# Altium schematic sheet 1_P1.schdoc
size 431 x 309 mm; Symbol: Sheet-Symbol_A3; Device: Sheet-Symbol_A3; Company: 嘉立创EDA; @Project Name: 蓝牙音响; @Page Count: 1; @Update Date: 2025-04-14; @Create Date: 2025-04-14; @Schematic Name: Schematic1_2; @Page No: 1; @Page Name: P1; @Board Name: 开发板; @Create Time: 15:54:00; @Update Time: 16:00:57
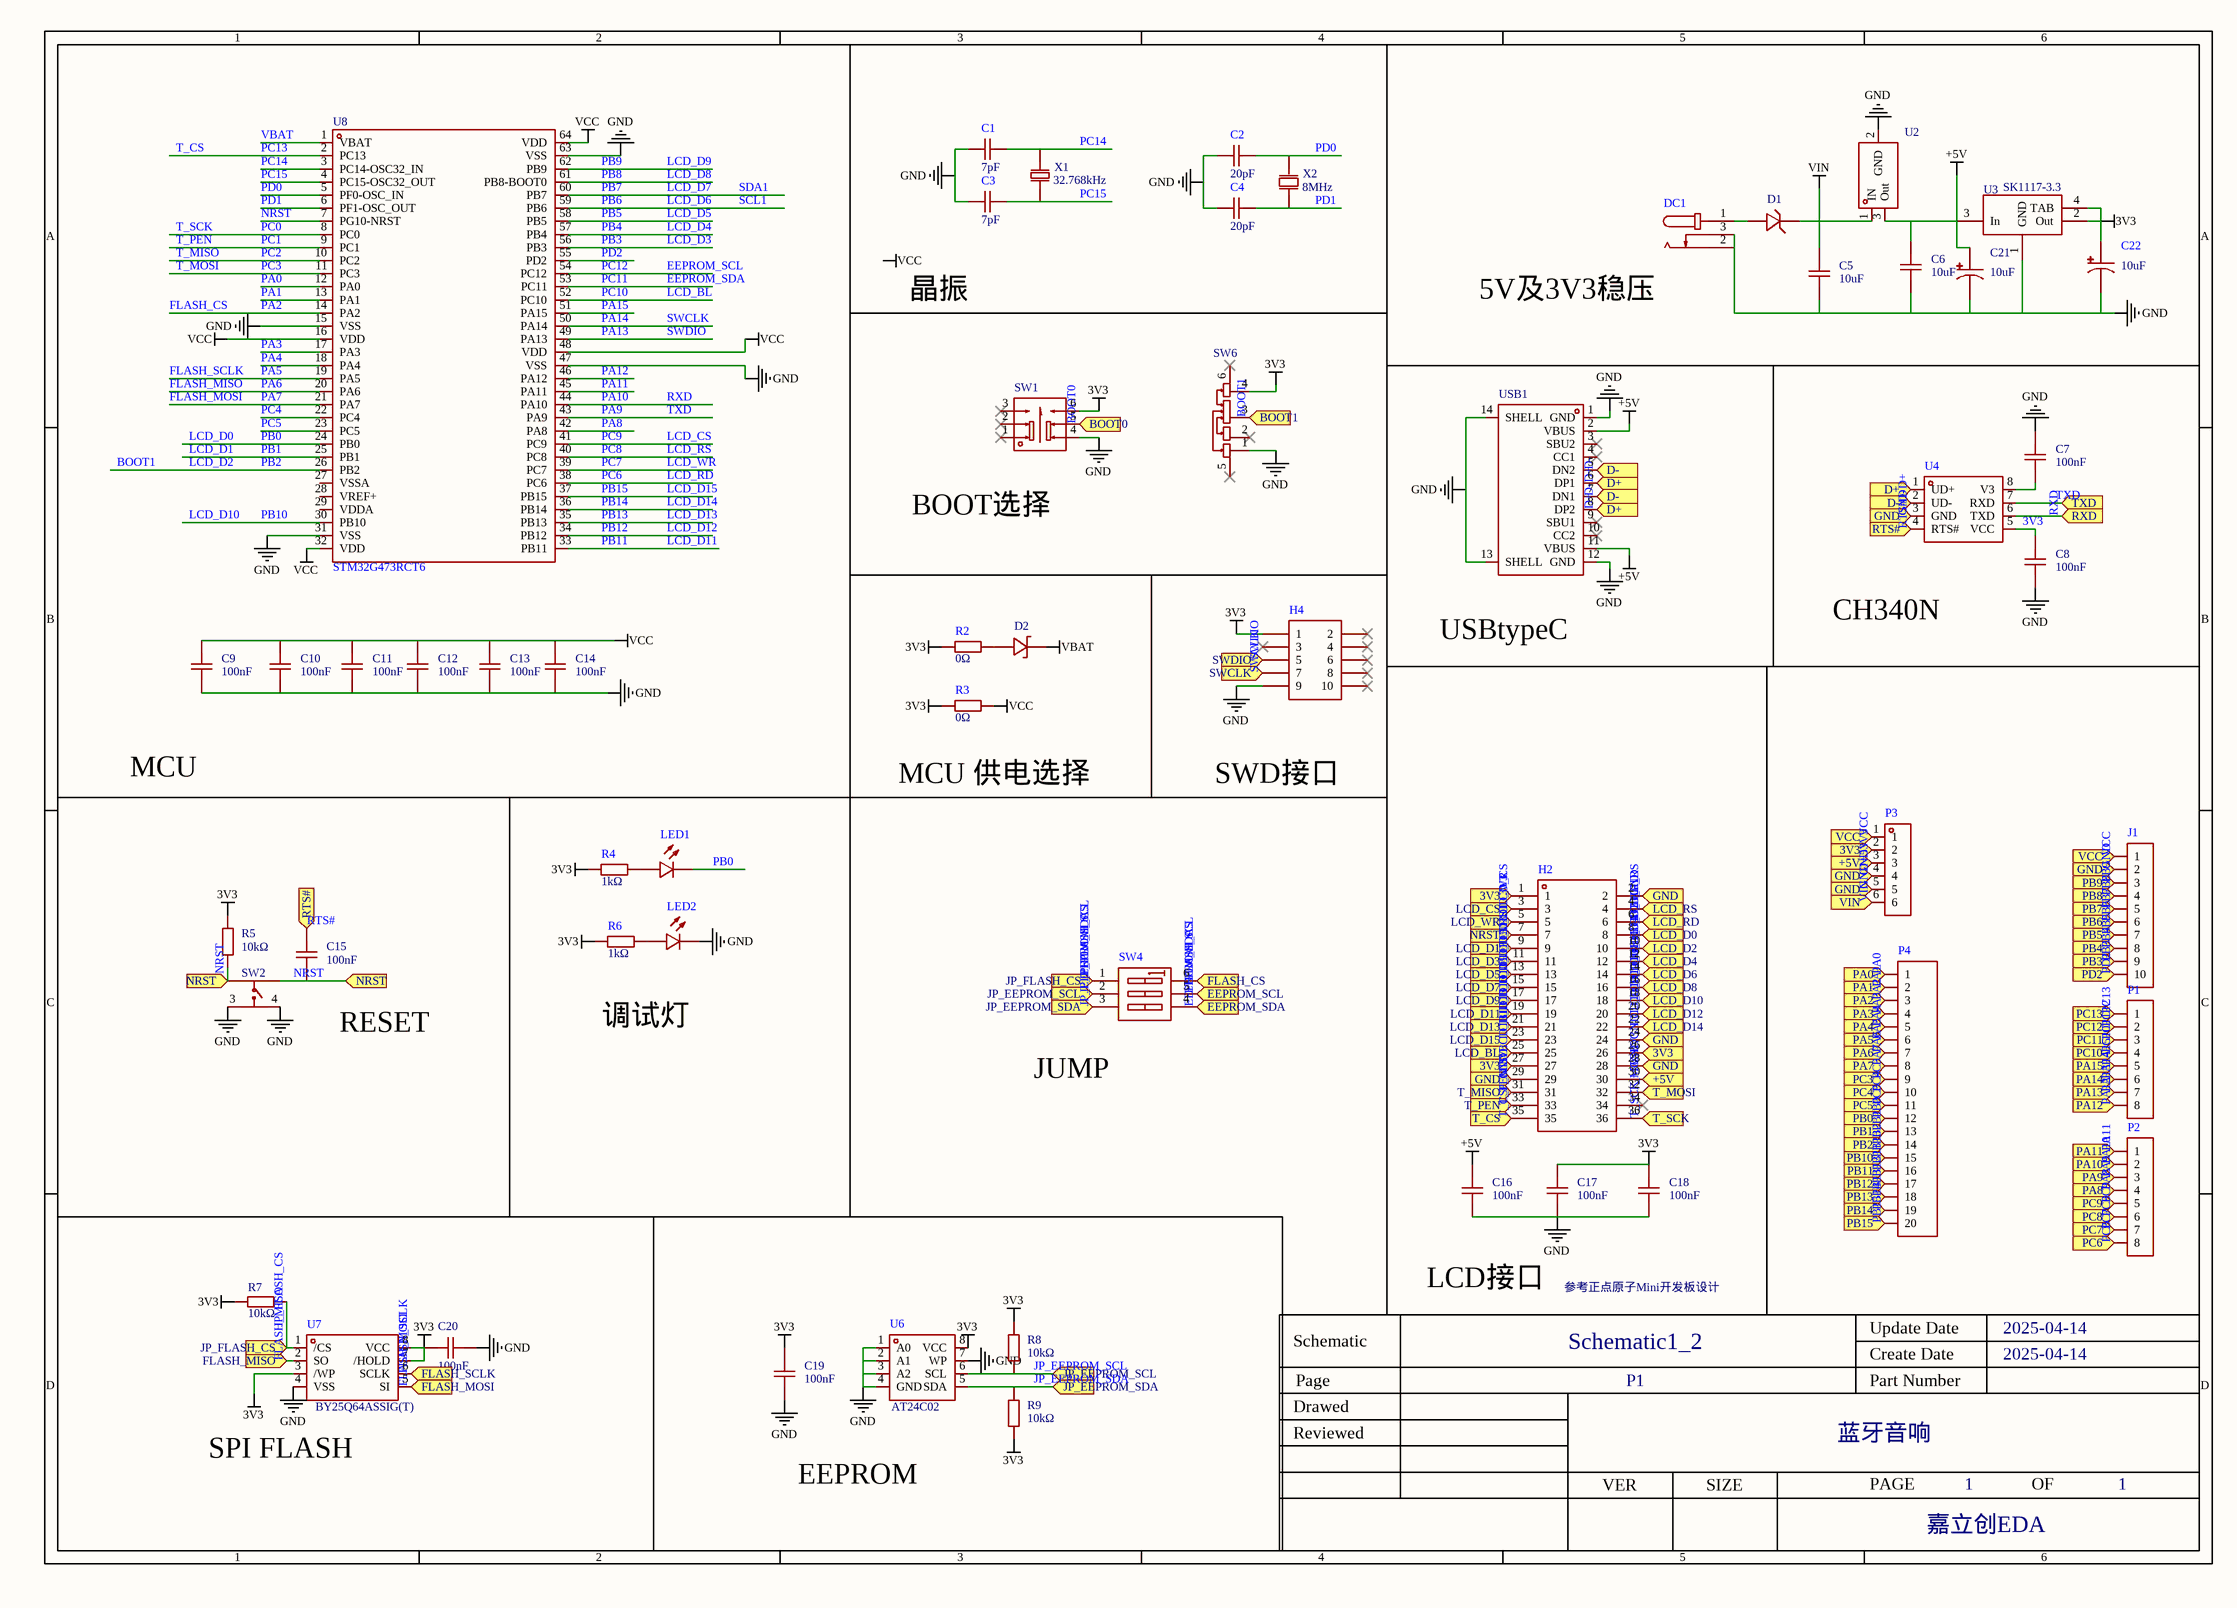
[diagram p0: 1_P1.schdoc]

## Parts
C1  7pF  [C0603]
C2  20pF  [C0603]
C3  7pF  [C0603]
C4  20pF  [C0603]
C5  value 10uF  [C0603]
C6  value 10uF  [C0603]
C7  value 100nF  [C0603]
C8  value 100nF  [C0603]
C9  100nF  [C0603]
C10  100nF  [C0603]
C11  100nF  [C0603]
C12  100nF  [C0603]
C13  100nF  [C0603]
C14  100nF  [C0603]
C15  100nF  [C0603]
C16  100nF  [C0603]
C17  100nF  [C0603]
C18  100nF  [C0603]
C19  100nF  [C0603]
C20  100nF  [C0603]
C21  10uF  [CAP-SMD_L3.2-W1.6]
C22  10uF  [CAP-SMD_L3.2-W1.6]
D1  (no value)  [SMA_L4.3-W2.7-LS5.1-RD]
D2  1N5819WS  [SOD-323_L1.8-W1.3-LS2.5-RD]  (value not drawn)
DC1  (no value)  [DC-IN-TH_DC-005-20A]
H2  DS1023-2*18SF11  [HDR-TH_36P-P2.54-V-F-R2-C18-S2.54-1]  (value not drawn)
H4  DS1023-2*5SF11  [HDR-TH_10P-P2.54-V-F-R2-C5-S2.54]  (value not drawn)
J1  (no value)  [HDR-TH_10P-P2.54-V-F]
LED1  19-217/GHC-YR1S2/3T  [LED0603-R-RD]  (value not drawn)
LED2  19-217/GHC-YR1S2/3T  [LED0603-R-RD]  (value not drawn)
P1  (no value)  [HDR-TH_8P-P2.54-V-F-1]
P2  (no value)  [HDR-TH_8P-P2.54-V-F-1]
P3  (no value)  [HDR-TH_6P-P2.54-V-F]
P4  2.54-1*20P母  [HDR-TH_20P-P2.54-V-F]  (value not drawn)
R2  0Ω  [R0603]
R3  0Ω  [R0603]
R4  value 1kΩ  [R0603]
R5  value 10kΩ  [R0603]
R6  value 1kΩ  [R0603]
R7  value 10kΩ  [R0603]
R8  value 10kΩ  [R0603]
R9  value 10kΩ  [R0603]
SW1  XKB5858-Z-75  [SW-TH_6P-L5.8-W5.8-P2.00-LS4.5-BL]  (value not drawn)
SW2  (no value)  [SW-SMD_4P-L4.5-W4.5-P3.00-LS6.8]
SW4  DSHP03TS-S  [SW-SMD_DSHP03TS-S]  (value not drawn)
SW6  K3-1311S-F1  [SW-SMD_K3-1311S-F1]  (value not drawn)
U2  (no value)  [TO-252-2_L6.6-W6.1-P4.58-LS10.1-BR-CW]
U3  (no value)  [SOT-223_L6.5-W3.5-P2.30-LS7.0-BR]
U4  (no value)  [SOP-8_L4.9-W3.9-P1.27-LS6.0-BL]
U6  AT24C02  [SOP-8_L5.0-W4.0-P1.27-LS6.0-BL]
U7  BY25Q64ASSIG(T)  [SOIC-8_L5.3-W5.3-P1.27-LS8.0-BL]
U8  STM32G473RCT6  [LQFP-64_L10.0-W10.0-P0.50-LS12.0-BL]
USB1  (no value)  [USB-C-SMD_TYPE-C-6PIN-2MD-073]
X1  32.768kHz  [FC-135R_L3.2-W1.5]
X2  8MHz  [CRYSTAL-SMD_L5.0-W3.2]

## Blocks framed on the sheet
MCU: C9-C14 U8
晶振: C1-C4 X1 X2
5V及3V3稳压: C5 C6 C21 C22 D1 DC1 U2 U3
USBtypeC: USB1
CH340N: C7 C8 U4
MCU 供电选择: D2 R2 R3
SWD接口: H4
LCD接口: C16-C18 H2
调试灯: LED1 LED2 R4 R6
SPI FLASH: C20 R7 U7
EEPROM: C19 R8 R9 U6

## Ports
3V3 (in), +5V (in), BOOT0 (in), BOOT1 (in), D+ (in), D- (in), EEPROM_SCL (in), EEPROM_SDA (in), FLASH_CS (in), FLASH_MISO (in), FLASH_MOSI (in), FLASH_SCLK (in), GND (in), JP_EEPROM_SCL (in), JP_EEPROM_SDA (in), JP_FLASH_CS (in), LCD_BL (in), LCD_CS (in), LCD_D0 (in), LCD_D1 (in), LCD_D2 (in), LCD_D3 (in), LCD_D4 (in), LCD_D5 (in), LCD_D6 (in), LCD_D7 (in), LCD_D8 (in), LCD_D9 (in), LCD_D10 (in), LCD_D11 (in), LCD_D12 (in), LCD_D13 (in), LCD_D14 (in), LCD_D15 (in), LCD_RD (in), LCD_RS (in), LCD_WR (in), NRST (in), PA0 (in), PA1 (in), PA2 (in), PA3 (in), PA4 (in), PA5 (in), PA6 (in), PA7 (in), PA8 (in), PA9 (in), PA10 (in), PA11 (in), PA12 (in), PA13 (in), PA14 (in), PA15 (in), PB0 (in), PB1 (in), PB2 (in), PB3 (in), PB4 (in), PB5 (in), PB6 (in), PB7 (in), PB8 (in), PB9 (in), PB10 (in), PB11 (in), PB12 (in), PB13 (in), PB14 (in), PB15 (in), PC3 (in), PC4 (in), PC5 (in), PC6 (in), PC7 (in), PC8 (in), PC9 (in), PC10 (in), PC11 (in), PC12 (in), PC13 (in), PD2 (in), RTS# (in), RXD (in), SWCLK (in), SWDIO (in), T_CS (in), T_MISO (in), T_MOSI (in), T_PEN (in), T_SCK (in), TXD (in), VCC (in), VIN (in)

## Nets
3V3: C8.1 C17.1 C18.1 C19.1 C20.1 C22.1 H2.1 H2.26 H2.27 H4.1 P3.2 R2.1 R3.1 R4.1 R5.2 R6.1 R7.2 R8.2 R9.1 SW1.6 SW6.4 U3.2(Out) U3.4(TAB) U4.5(VCC) U6.8(VCC) U7.3(/WP) U7.7(/HOLD) U7.8(VCC) ; port 3V3
+5V: C6.1 C16.1 C21.1 H2.30 P3.3 U2.3(Out) U3.3(In) USB1.2(VBUS) USB1.11(VBUS) ; port +5V
GND: C1.1 C2.1 C3.1 C4.1 C5.2 C6.2 C7.1 C8.2 C9.2 C10.2 C11.2 C12.2 C13.2 C14.2 C16.2 C17.2 C18.2 C19.2 C20.2 C21.2 C22.2 DC1.2 DC1.3 H2.2 H2.24 H2.28 H2.29 H4.9 J1.2 LED2.2(C) P3.4 P3.5 SW1.4 SW2.3 SW2.4 SW6.1 U2.2(GND) U3.1(GND) U4.3(GND) U6.1(A0) U6.2(A1) U6.3(A2) U6.4(GND) U6.7(WP) U7.4(VSS) U8.15(VSS) U8.31(VSS) U8.47(VSS) U8.63(VSS) USB1.1(GND) USB1.12(GND) USB1.13(SHELL) USB1.14(SHELL) ; port GND
VBAT: D2.1(C) U8.1(VBAT)
VCC: C9.1 C10.1 C11.1 C12.1 C13.1 C14.1 J1.1 P3.1 R3.2 U8.16(VDD) U8.32(VDD) U8.48(VDD) U8.64(VDD) ; port VCC
VIN: C5.1 D1.1(C) P3.6 U2.1(IN) ; port VIN
BOOT0: SW1.5 ; port BOOT0
BOOT1: H2.10 P4.14 SW6.3 U8.26(PB2) ; port LCD_D2, port BOOT1, port PB2  [also labelled LCD_D2, PB2]
D+: U4.1(UD+) USB1.6(DP1) USB1.8(DP2) ; port D+
D-: U4.2(UD-) USB1.5(DN2) USB1.7(DN1) ; port D-
EEPROM_SCL: P1.2 SW4.5 U8.54(PC12) ; port EEPROM_SCL, port PC12  [also labelled PC12]
EEPROM_SDA: P1.3 SW4.4 U8.53(PC11) ; port EEPROM_SDA, port PC11  [also labelled PC11]
FLASH_CS: P4.3 SW4.6 U8.14(PA2) ; port FLASH_CS, port PA2  [also labelled PA2]
FLASH_MISO: P4.7 U7.2(SO) U8.20(PA6) ; port FLASH_MISO, port PA6  [also labelled PA6]
FLASH_MOSI: P4.8 U7.5(SI) U8.21(PA7) ; port FLASH_MOSI, port PA7  [also labelled PA7]
FLASH_SCLK: P4.6 U7.6(SCLK) U8.19(PA5) ; port FLASH_SCLK, port PA5  [also labelled PA5]
JP_EEPROM_SCL: R8.1 SW4.2 U6.6(SCL) ; port JP_EEPROM_SCL
JP_EEPROM_SDA: R9.2 SW4.3 U6.5(SDA) ; port JP_EEPROM_SDA
JP_FLASH_CS: R7.1 SW4.1 U7.1(/CS) ; port JP_FLASH_CS
LCD_BL: H2.25 P1.4 U8.52(PC10) ; port LCD_BL, port PC10  [also labelled PC10]
LCD_CS: H2.3 P2.5 U8.41(PC9) ; port PC9, port LCD_CS  [also labelled PC9]
LCD_D0: H2.8 LED1.2(C) P4.12 U8.24(PB0) ; port LCD_D0, port PB0  [also labelled PB0]
LCD_D1: H2.9 P4.13 U8.25(PB1) ; port LCD_D1, port PB1  [also labelled PB1]
LCD_D3: H2.11 J1.9 U8.56(PB3) ; port LCD_D3, port PB3  [also labelled PB3]
LCD_D4: H2.12 J1.8 U8.57(PB4) ; port LCD_D4, port PB4  [also labelled PB4]
LCD_D5: H2.13 J1.7 U8.58(PB5) ; port LCD_D5, port PB5  [also labelled PB5]
LCD_D6: H2.14 J1.6 U8.59(PB6) ; port LCD_D6, port PB6  [also labelled PB6, SCL1]
LCD_D7: H2.15 J1.5 U8.60(PB7) ; port LCD_D7, port PB7  [also labelled PB7, SDA1]
LCD_D8: H2.16 J1.4 U8.61(PB8-BOOT0) ; port LCD_D8, port PB8  [also labelled PB8]
LCD_D9: H2.17 J1.3 U8.62(PB9) ; port LCD_D9, port PB9  [also labelled PB9]
LCD_D10: H2.18 P4.15 U8.30(PB10) ; port LCD_D10, port PB10  [also labelled PB10]
LCD_D11: H2.19 P4.16 U8.33(PB11) ; port LCD_D11, port PB11  [also labelled PB11]
LCD_D12: H2.20 P4.17 U8.34(PB12) ; port LCD_D12, port PB12  [also labelled PB12]
LCD_D13: H2.21 P4.18 U8.35(PB13) ; port LCD_D13, port PB13  [also labelled PB13]
LCD_D14: H2.22 P4.19 U8.36(PB14) ; port LCD_D14, port PB14  [also labelled PB14]
LCD_D15: H2.23 P4.20 U8.37(PB15) ; port LCD_D15, port PB15  [also labelled PB15]
LCD_RD: H2.6 P2.8 U8.38(PC6) ; port PC6, port LCD_RD  [also labelled PC6]
LCD_RS: H2.4 P2.6 U8.40(PC8) ; port PC8, port LCD_RS  [also labelled PC8]
LCD_WR: H2.5 P2.7 U8.39(PC7) ; port PC7, port LCD_WR  [also labelled PC7]
NRST: C15.1 H2.7 R5.1 SW2.1 SW2.2 U8.7(PG10-NRST) ; port NRST
PA0: P4.1 U8.12(PA0) ; port PA0
PA1: P4.2 U8.13(PA1) ; port PA1
PA3: P4.4 U8.17(PA3) ; port PA3
PA4: P4.5 U8.18(PA4) ; port PA4
PA8: P2.4 U8.42(PA8) ; port PA8
PA9: P2.3 U4.7(RXD) U8.43(PA9) ; port TXD, port PA9  [also labelled TXD]
PA10: P2.2 U4.6(TXD) U8.44(PA10) ; port RXD, port PA10  [also labelled RXD]
PA11: P2.1 U8.45(PA11) ; port PA11
PA12: P1.8 U8.46(PA12) ; port PA12
PA13: H4.5 P1.7 U8.49(PA13) ; port SWDIO, port PA13  [also labelled SWDIO]
PA14: H4.7 P1.6 U8.50(PA14) ; port SWCLK, port PA14  [also labelled SWCLK]
PA15: P1.5 U8.51(PA15) ; port PA15
PC0: H2.36 U8.8(PC0) ; port T_SCK  [also labelled T_SCK]
PC1: H2.33 U8.9(PC1) ; port T_PEN  [also labelled T_PEN]
PC2: H2.31 U8.10(PC2) ; port T_MISO  [also labelled T_MISO]
PC3: H2.32 P4.9 U8.11(PC3) ; port T_MOSI, port PC3  [also labelled T_MOSI]
PC4: P4.10 U8.22(PC4) ; port PC4
PC5: P4.11 U8.23(PC5) ; port PC5
PC13: H2.35 P1.1 U8.2(PC13) ; port T_CS, port PC13  [also labelled T_CS]
PC14: C1.2 U8.3(PC14-OSC32_IN) X1.1
PC15: C3.2 U8.4(PC15-OSC32_OUT) X1.2
PD0: C2.2 U8.5(PF0-OSC_IN) X2.2(OSC2)
PD1: C4.2 U8.6(PF1-OSC_OUT) X2.1(OSC1)
PD2: J1.10 U8.55(PD2) ; port PD2
RTS#: C15.2 U4.4(RTS#) ; port RTS#
NetC7_2: C7.2 U4.8(V3)
NetD1_2: D1.2(A) DC1.1
NetD2_2: D2.2(A) R2.2
NetLED1_1: LED1.1(A) R4.2
NetLED2_1: LED2.1(A) R6.2

Not connected (* = marked no-connect by the designer): H2 34*; H4 2* 3* 4* 6* 8* 10*; SW1 1* 2* 3*; SW6 2* 5* 6*; U8 27(VSSA) 28(VREF+) 29(VDDA); USB1 3(SBU2)* 4(CC1)* 9(SBU1)* 10(CC2)*

## Notes on the sheet
- BOOT选择
- RESET
- JUMP
- 参考正点原子Mini开发板设计
- Labels drawn without touching a wire or pin: VCC
- 1
- 2
- 3
- 4
- 5
- 6
- A
- B
- C
- Schematic
- Schematic1_2
- Create Date
- Update Date
- 2025-04-14
- D
- Reviewed
- Drawed
- Page
- P1
- Part Number
- 蓝牙音响
- VER
- SIZE
- PAGE
- OF
- 嘉立创EDA

## Library data of the parts
C1 C3 = 0603CG7R0C500NT: Manufacturer: FH(风华); Add into BOM: yes; Temperature Coefficient: C0G; Tolerance: ±0.25pF; Voltage Rated: 50V; Symbol: 0603CG7R0C500NT; Device: 0603CG7R0C500NT; LCSC Part Name: 7.0pF(7R0) ±0.25pF 50V; Supplier Part: C1682; Manufacturer Part: 0603CG7R0C500NT; Supplier Footprint: 0603; JLCPCB Part Class: Extended Part; Datasheet: https://atta.szlcsc.com/upload/public/pdf/source/20170923/C1682_1506149316801988467.pdf; Supplier: LCSC; Convert to PCB: yes; Value: 7pF
C2 C4 = CL10C200JB8NNNC: Manufacturer: SAMSUNG(三星); Add into BOM: yes; Tolerance: ±5%; Voltage Rated: 50V; Temperature Coefficient: C0G; Symbol: CL10C200JB8NNNC; Device: CL10C200JB8NNNC; LCSC Part Name: 20pF ±5% 50V; Supplier Part: C1648; Manufacturer Part: CL10C200JB8NNNC; Supplier Footprint: 0603; JLCPCB Part Class: Basic Part; Datasheet: https://atta.szlcsc.com/upload/public/pdf/source/20160103/1457707686863.pdf; Supplier: LCSC; Convert to PCB: yes; Value: 20pF
C5 C6 = GRM188R6YA106MA73D: Manufacturer: muRata(村田); Add into BOM: yes; Tolerance: ±20%; Voltage Rated: 35V; Symbol: GRM188R6YA106MA73D; Device: GRM188R6YA106MA73D; LCSC Part Name: 10uF ±20% 35V; Supplier Part: C194427; Manufacturer Part: GRM188R6YA106MA73D; Supplier Footprint: 0603; JLCPCB Part Class: Extended Part; Datasheet: https://atta.szlcsc.com/upload/public/pdf/source/20210128/C194427_FCA3640823207DDB58700A82F1A19B5F.pdf; Supplier: LCSC; Convert to PCB: yes; Temperature Coefficient: -
C7-C20 = CL10B104KB8NNNC: Manufacturer: SAMSUNG(三星); Add into BOM: yes; Tolerance: ±10%; Voltage Rated: 50V; Temperature Coefficient: X7R; Symbol: CL10B104KB8NNNC; Device: CL10B104KB8NNNC; LCSC Part Name: 100nF ±10% 50V; Supplier Part: C1591; Manufacturer Part: CL10B104KB8NNNC; Supplier Footprint: 0603; JLCPCB Part Class: Extended Part; Datasheet: https://atta.szlcsc.com/upload/public/pdf/source/20160103/1457707680512.pdf; Supplier: LCSC; Convert to PCB: yes
  C9-C20: Value: 100nF
C21 C22 = CA45-A-10V-10μF-K: Manufacturer: TORCH(火炬); Manufacturer Part: CA45-A-10V-10F-K; Add into BOM: yes; Tolerance: ±10%; Rated Voltage: 10V; Equivalent Series Resistance(ESR): 2Ω@100kHz; Symbol: CA45-A-10V-10μF-K; Device: CA45-A-10V-10μF-K; LCSC Part Name: 10uF ±10% 10V; Supplier Part: C185772; Supplier Footprint: CASE-A_3216; JLCPCB Part Class: Extended Part; Datasheet: https://atta.szlcsc.com/upload/public/pdf/source/20180731/C185772_E7211F12E29FD5EB4FF91915412D06A7.pdf; Supplier: LCSC; Convert to PCB: yes; Value: 10uF; Operating Temperature: -55~+125
D1 = SS34: Manufacturer: UMW(友台半导体); Symbol: SS34_C2758579; Add into BOM: yes; Reverse Voltage (Vr): 40V; Average Rectified Current (Io): 3A; Forward Voltage (Vf@If): 500mV@3A; Reverse Leakage Current (Ir): 500A@40V; Device: SS34; LCSC Part Name: 40V 3A 500mV@3A SMA; Supplier Part: C2758579; Manufacturer Part: SS34; Supplier Footprint: SMA; JLCPCB Part Class: Extended Part; Datasheet: https://atta.szlcsc.com/upload/public/pdf/source/20220418/7C9A7A5F28739A25B4A7AFFB8E50421C.pdf; Supplier: LCSC; Convert to PCB: yes; Diode Configuration: -
D2 = 1N5819WS_C191023: Manufacturer: Hottech(合科泰); Add into BOM: yes; Reverse Voltage (Vr): 40V; Average Rectified Current (Io): 1A; Forward Voltage (Vf@If): 600mV@1A; Symbol: 1N5819WS; Device: 1N5819WS_C191023; LCSC Part Name: 40V 1A 600mV@1A; Supplier Part: C191023; Manufacturer Part: 1N5819WS; Supplier Footprint: SOD-323; JLCPCB Part Class: Basic Part; Datasheet: https://atta.szlcsc.com/upload/public/pdf/source/20180614/C191023_3C6A6398B911F3A4C23E7538EE054643.pdf; Supplier: LCSC; Convert to PCB: yes
DC1 = DC-005-20A: Manufacturer: 韩国韩荣; Symbol: DC-005-20A_C136744; Add into BOM: yes; Inside Contact Diameter: 2mm; Outside Contact Diameter: 6.4mm; Current Rating (Max): 500mA; Voltage Rating (Max): 30V; Device: DC-005-20A; LCSC Part Name: 内径:2mm 外径:6.4mm 全铜; Supplier Part: C136744; Manufacturer Part: DC-005-20A; Supplier Footprint: 插件; JLCPCB Part Class: Extended Part; Datasheet: https://atta.szlcsc.com/upload/public/pdf/source/20210810/D1FE451D887B1804F0660F580C4AD849.pdf; Supplier: LCSC; Convert to PCB: yes
H2 = DS1023-2*18SF11: Manufacturer: CONNFLY; Add into BOM: yes; Pitch: 2.54mm; Number of Holes: 36; Holes Structure: 2x18P; Symbol: DS1023-2*18SF11; Device: DS1023-2*18SF11; LCSC Part Name: 2.54mm 2x18P; Supplier Part: C132131; Manufacturer Part: DS1023-2*18SF11; Supplier Footprint: 直插,P=2.54mm; JLCPCB Part Class: Extended Part; Datasheet: https://atta.szlcsc.com/upload/public/pdf/source/20170925/C132131_1506321658451990427.pdf; Supplier: LCSC; Convert to PCB: yes; Number of Rows: 2; Row Spacing: 2.54mm; Mounting Type: 直插; Insulation Height: -; Contact Material: -; Contact Plating: -
H4 = DS1023-2*5SF11: Manufacturer: CONNFLY; Add into BOM: yes; Pitch: 2.54mm; Number of Holes: 10; Holes Structure: 2x5P; Symbol: DS1023-2*5SF11; Device: DS1023-2*5SF11; LCSC Part Name: 2.54mm 2x5P; Supplier Part: C92270; Manufacturer Part: DS1023-2*5SF11; Supplier Footprint: 直插,P=2.54mm; JLCPCB Part Class: Extended Part; Datasheet: https://atta.szlcsc.com/upload/public/pdf/source/20170116/1484561256747.pdf; Supplier: LCSC; Convert to PCB: yes; Number of Rows: 2; Row Spacing: 2.54mm; Mounting Type: 直插; Insulation Height: -; Contact Material: -; Contact Plating: -
J1 = 2.54-1*10P母: Manufacturer: BOOMELE(博穆精密); Symbol: Header-Female-2.54_1x10; Add into BOM: yes; Pitch: 2.54mm; Number of Holes: 10; Holes Structure: 1x10P; Device: 2.54-1*10P母; LCSC Part Name: 2.54mm 镀金; Supplier Part: C35445; Manufacturer Part: 2.54-1*10P母; Supplier Footprint: 插件,P=2.54mm; JLCPCB Part Class: Extended Part; Datasheet: https://atta.szlcsc.com/upload/public/pdf/source/20200813/C35445_A4147CED0A1C9075722E373C7771E928.pdf; Supplier: LCSC; Convert to PCB: yes; Number of Rows: 1; Row Spacing: -; Mounting Type: 直插; Insulation Height: -; Contact Material: -; Contact Plating: -
LED1 LED2 = 19-217/GHC-YR1S2/3T: Manufacturer: EVERLIGHT(台湾亿光); Add into BOM: yes; Illumination Color: 翠绿; Luminous Intensity (IF=20mA): 112~258mcd; Dominant Wavelength / Coordinate rank: 520~535nm; Symbol: 19-217/GHC-YR1S2/3T; Device: 19-217/GHC-YR1S2/3T; LCSC Part Name: 翠绿LED; Supplier Part: C72043; Manufacturer Part: 19-217/GHC-YR1S2/3T; Supplier Footprint: 0603; JLCPCB Part Class: Basic Part; Datasheet: https://atta.szlcsc.com/upload/public/pdf/source/20160507/1462613613780.pdf; Supplier: LCSC; Convert to PCB: yes; Mounting Type: 表面贴装; Correlated Color Temperature - CCT(K): -; Luminous Flux/Radiant Flux: -
P1 P2 = 2.54-1*8P母环保: Manufacturer: BOOMELE(博穆精密); Symbol: Header-Female-2.54_1x8; Add into BOM: yes; Pitch: 2.54mm; Number of Holes: 8; Holes Structure: 1x8P; Device: 2.54-1*8P母环保; LCSC Part Name: 2.54mm; Supplier Part: C27438; Manufacturer Part: 2.54-1*8P母环保; Supplier Footprint: 插件,P=2.54mm; JLCPCB Part Class: Extended Part; Datasheet: https://atta.szlcsc.com/upload/public/pdf/source/20151109/1457707554453.pdf; Supplier: LCSC; Convert to PCB: yes; Number of Rows: 1; Row Spacing: -; Mounting Type: 直插; Insulation Height: -; Contact Material: -; Contact Plating: -
P3 = 2.54-1*6P母: Manufacturer: BOOMELE(博穆精密); Symbol: Header-Female-2.54_1x6; Add into BOM: yes; Pitch: 2.54mm; Number of Holes: 6; Holes Structure: 1x6P; Device: 2.54-1*6P母; LCSC Part Name: 2.54mm; Supplier Part: C40877; Manufacturer Part: 2.54-1*6P母; Supplier Footprint: 插件,P=2.54mm; JLCPCB Part Class: Extended Part; Datasheet: https://atta.szlcsc.com/upload/public/pdf/source/20151109/1457707559772.pdf; Supplier: LCSC; Convert to PCB: yes; Number of Rows: 1; Row Spacing: -; Mounting Type: 直插; Insulation Height: -; Contact Material: -; Contact Plating: -
P4 = 2.54-1*20P母: Manufacturer: BOOMELE(博穆精密); Symbol: Header-Female-2.54_1x20; Add into BOM: yes; Pitch: 2.54mm; Number of Holes: 20; Holes Structure: 1x20P; Device: 2.54-1*20P母; LCSC Part Name: 2.54mm 1x20P; Supplier Part: C50984; Manufacturer Part: 2.54-1*20P母; Supplier Footprint: 直插,P=2.54mm; JLCPCB Part Class: Extended Part; Datasheet: https://atta.szlcsc.com/upload/public/pdf/source/20151109/1457707571590.pdf; Supplier: LCSC; Convert to PCB: yes; Number of Rows: 1; Row Spacing: -; Mounting Type: 直插; Insulation Height: -; Contact Material: -; Contact Plating: -
R2 R3 = 0603WAF0000T5E: Manufacturer: UNI-ROYAL(厚声); Add into BOM: yes; Tolerance: ±1%; Power(Watts): 1/10W; Overload Voltage (Max): 75V; Symbol: 0603WAF0000T5E; Device: 0603WAF0000T5E; LCSC Part Name: 0Ω ±1%; Supplier Part: C21189; Manufacturer Part: 0603WAF0000T5E; Supplier Footprint: 0603; JLCPCB Part Class: Basic Part; Datasheet: https://atta.szlcsc.com/upload/public/pdf/source/20170920/C21189_1505887441435980537.pdf; Supplier: LCSC; Convert to PCB: yes; Temperature Coefficient: -; Value: 0Ω; Operating Temperature Range: -55~+155
R4 R6 = 0603WAF1001T5E: Manufacturer: UNI-ROYAL(厚声); Add into BOM: yes; Tolerance: ±1%; Power(Watts): 1/10W; Temperature Coefficient: ±100ppm/; Overload Voltage (Max): 75V; Symbol: 0603WAF1001T5E; Device: 0603WAF1001T5E; LCSC Part Name: 1kΩ ±1% 1/10W; Supplier Part: C21190; Manufacturer Part: 0603WAF1001T5E; Supplier Footprint: 0603; JLCPCB Part Class: Basic Part; Datasheet: https://atta.szlcsc.com/upload/public/pdf/source/20200306/C422600_1E6D84923E4A46A82E41ADD87F860B5C.pdf; Supplier: LCSC; Convert to PCB: yes; Type: 厚膜电阻; Operating Temperature Range: -55~+155
R5 R7-R9 = 0603WAF1002T5E: Manufacturer: UNI-ROYAL(厚声); Add into BOM: yes; Tolerance: ±1%; Power(Watts): 1/10W; Temperature Coefficient: ±100ppm/; Overload Voltage (Max): 75V; Symbol: 0603WAF1002T5E; Device: 0603WAF1002T5E; LCSC Part Name: 10kΩ ±1% 1/10W; Supplier Part: C25804; Manufacturer Part: 0603WAF1002T5E; Supplier Footprint: 0603; JLCPCB Part Class: Basic Part; Datasheet: https://atta.szlcsc.com/upload/public/pdf/source/20200306/C422600_1E6D84923E4A46A82E41ADD87F860B5C.pdf; Supplier: LCSC; Convert to PCB: yes; Type: 厚膜电阻; Operating Temperature Range: -55~+155
SW1 = XKB5858-Z-75: Manufacturer: XKB Connectivity(中国星坤); Add into BOM: yes; Contact Current: 100mA; Voltage Rating (AC): 250V; Voltage Rating (DC): 30V; Insulation Resistance: 100MΩ; Self Lock / No Lock: 自锁; Actuator Style: 矩形按钮; Actuator/Cap Color: 白色; With Lamp: 无; Pin Style: PC引脚; Operating Force: 160gf@±80gf; Mechanical Life: 100000; Symbol: XKB5858-Z-75; Device: XKB5858-Z-75; LCSC Part Name: 按键开关   5.8*5.8平头插件自锁; Supplier Part: C318867; Manufacturer Part: XKB5858-Z-75; Supplier Footprint: 插件; JLCPCB Part Class: Extended Part; Datasheet: https://atta.szlcsc.com/upload/public/pdf/source/20211015/E8FF4C3DDBC8F92846022CE1A2284A29.pdf; Supplier: LCSC; Convert to PCB: yes; Mounting Style: 直插; IP Rating: -; Operating Temperature: -15~+55
SW2 = 4.5x4.5x3.8贴片: Manufacturer: BOOMELE(博穆精密); Add into BOM: yes; Symbol: 4.5X4.5X3.8贴片; Device: 4.5x4.5x3.8贴片; LCSC Part Name: 4.5x4.5x3.8贴片; Supplier Part: C2897501; Manufacturer Part: 4.5x4.5x3.8贴片; Supplier Footprint: SMD; JLCPCB Part Class: Extended Part; Datasheet: https://atta.szlcsc.com/upload/public/pdf/source/20200916/C174049_C7EFE601E72DB861B2B81D6E1A27ADFA.pdf; Supplier: LCSC; Convert to PCB: yes
SW4 = DSHP03TS-S: Manufacturer: XKB Connectivity(中国星坤); Add into BOM: yes; Current Rating: 25mA; Voltage Rating: 24V; Circuit: 单刀单掷; Number of Positions: 3; Pin Style: 鸥翼型; Operating Life: 3000; Symbol: DSHP03TS-S; Device: DSHP03TS-S; LCSC Part Name: 1.27mm,1位,3P; Supplier Part: C319051; Manufacturer Part: DSHP03TS-S; Supplier Footprint: SMD; JLCPCB Part Class: Extended Part; Datasheet: https://atta.szlcsc.com/upload/public/pdf/source/20211009/11BE85C99D2C85B0991AF4F9D6EB8BDE.pdf; Supplier: LCSC; Convert to PCB: yes; Type: 平拨，凹槽式; Lead Pitch: 1.27mm; Operating Temperature: -20~+70; Color: 黑色
SW6 = K3-1311S-F1: Manufacturer: 韩国韩荣; Add into BOM: yes; Current Rating (DC): 300mA; Voltage Rating (DC): 4V; Circuit: 单刀3掷; Mechanical Life: 10000; Actuator Color: 黑色; Actuator Style: 矩形柱状; Pin Style: SMD接片; Switch Length: 9.7mm; Switch Width: 2.7mm; Switch Height: 1.4mm; Symbol: K3-1311S-F1; Device: K3-1311S-F1; LCSC Part Name: K3-1311S-F1; Supplier Part: C2911497; Manufacturer Part: K3-1311S-F1; Supplier Footprint: SMD; JLCPCB Part Class: Extended Part; Datasheet: https://atta.szlcsc.com/upload/public/pdf/source/20211111/04493B67A76465E99EE0BE9E5992F83D.pdf; Supplier: LCSC; Convert to PCB: yes; Mounting Style: 卧贴; Operating Temperature: -25~+80
U2 = CJ7805 3%: Manufacturer: CJ（江苏长电/长晶）; Add into BOM: yes; Output Type: 固定; Output Polarity: 正; Number of Outputs: 1; Maximum Input Voltage: 35V; Output Voltage: 5V; Dropout Voltage: 2V@(1A); Output Current: 1.5A; Symbol: CJ7805 3%; Device: CJ7805 3%; LCSC Part Name: Vin=35V Vout=5V 1.5A 3%; Supplier Part: C21706; Manufacturer Part: CJ7805 3%; Supplier Footprint: TO-252-2(DPAK); JLCPCB Part Class: Extended Part; Datasheet: https://atta.szlcsc.com/upload/public/pdf/source/20171106/C21706_15099535628491092916.pdf; Supplier: LCSC; Convert to PCB: yes
U3 = SK1117-3.3: Manufacturer: SHIKUES(时科); Symbol: AMS1117-3.3_C165482; Add into BOM: yes; Device: SK1117-3.3; LCSC Part Name: SK1117-3.3; Supplier Part: C165482; Manufacturer Part: SK1117-3.3; Supplier Footprint: SOT-223; JLCPCB Part Class: Extended Part; Datasheet: https://atta.szlcsc.com/upload/public/pdf/source/20190505/C165482_82C1AFFA508C9159D3B5A1FBC2B4A936.pdf; Supplier: LCSC; Convert to PCB: yes
U4 = CH340N: Manufacturer: WCH(南京沁恒); Symbol: CH340N_C2977777; Add into BOM: yes; Device: CH340N; LCSC Part Name: CH340N; Supplier Part: C2977777; Manufacturer Part: CH340N; Supplier Footprint: SOP-8; JLCPCB Part Class: Extended Part; Datasheet: https://atta.szlcsc.com/upload/public/pdf/source/20220223/82A45E4FF89B3EDCAD50B354450A7EF4.pdf; Supplier: LCSC; Convert to PCB: yes
U6 = AT24C02: Manufacturer: IDCHIP(英锐芯); Add into BOM: yes; Symbol: AT24C02; Device: AT24C02; LCSC Part Name: AT24C02; Supplier Part: C688857; Manufacturer Part: AT24C02; Supplier Footprint: SOP-8; JLCPCB Part Class: Extended Part; Datasheet: https://atta.szlcsc.com/upload/public/pdf/source/20200619/C688857_168265888F77B455D6D4136881F4BB15.pdf; Supplier: LCSC; Convert to PCB: yes
U7 = BY25Q64ASSIG(T): Manufacturer: BOYAMICRO(博雅); Add into BOM: yes; Symbol: BY25Q64ASSIG(T); Device: BY25Q64ASSIG(T); LCSC Part Name: BY25Q64ASSIG(T); Supplier Part: C484306; Manufacturer Part: BY25Q64ASSIG(T); Supplier Footprint: SOP-8_208mil; JLCPCB Part Class: Extended Part; Datasheet: https://atta.szlcsc.com/upload/public/pdf/source/20200115/C484306_247CE91A1CD6630E225A23B41696B60B.pdf; Supplier: LCSC; Convert to PCB: yes; Memory Type: -; Memory Format: -; Technology: -; Memory Size: -; Clock Frequency: -; Byte-Program Time - tBP: -; Page Programming Time - tPP: -; Memory Interface: -; Voltage - Supply: -; Operating Temperature: -
U8 = STM32G473RCT6: Manufacturer: ST(意法半导体); Add into BOM: yes; CPU Core: ARM-M4; CPU Maximum Speed: 170MHz; Program Storage Size: 256KB; Program Memory Type: FLASH; Number of I/O: 52; ADC (Bit): 12bit; Low Voltage Detection Threshold: 1.71V~3.6V; Symbol: STM32G473RCT6; Device: STM32G473RCT6; LCSC Part Name: 带DSP和FPU的170MHz主流ARM Cortex-M4 MCU，具有256 KB Flash存储器、数学加速器和高模拟电平集成; Supplier Part: C529361; Manufacturer Part: STM32G473RCT6; Supplier Footprint: LQFP-64(10x10); JLCPCB Part Class: 扩展库; Datasheet: https://atta.szlcsc.com/upload/public/pdf/source/20200511/C529412_744FBB42E5E81FF9381EF04F70DE3FB2.pdf; Supplier: LCSC; Convert to PCB: yes; DAC (Bit): 12bit; Application Area: -
USB1 = TYPE-C 16PIN 2MD(073): Manufacturer: SHOU HAN(首韩); Add into BOM: yes; Connector Type: Type-C; Gender: 母座; Number of Contacts: 16; Number of Ports: 1; Current Rating - Power (Max): 5A; Symbol: TYPE-C 16PIN 2MD(073); Device: TYPE-C 16PIN 2MD(073); LCSC Part Name: Type-C 母座 卧贴 带定位柱 不锈钢外壳 2次模顶; Supplier Part: C2765186; Manufacturer Part: TYPE-C 16PIN 2MD(073); Supplier Footprint: SMD; JLCPCB Part Class: Extended Part; Datasheet: https://atta.szlcsc.com/upload/public/pdf/source/20211123/39B17C16241EAC15C5E277BDA434118E.pdf; Supplier: LCSC; Convert to PCB: yes; Standard: -; Mounting Style: 卧贴; Operating Temperature Range: -25~+85
X1 = Q13FC1350000200: Manufacturer: EPSON(爱普生); Add into BOM: yes; Crystal Type: 贴片无源晶振; Frequency Tolerance: ±20ppm; Load Capacitance: 7pF; Equivalent Series Resistance (ESR): 70kΩ; Symbol: Q13FC1350000200; Device: Q13FC1350000200; LCSC Part Name: 32.768kHz ±20ppm 7pF; Supplier Part: C48615; Manufacturer Part: Q13FC1350000200; Supplier Footprint: SMD3215-2P; JLCPCB Part Class: Extended Part; Datasheet: https://atta.szlcsc.com/upload/public/pdf/source/20150504/1457707284999.pdf; Supplier: LCSC; Convert to PCB: yes; Value: 32.768kHz; Frequency Stability: -; Operating Temperature: -40~+85
X2 = X50328MSB2GI: Manufacturer: YXC扬兴科技; Add into BOM: yes; Crystal Type: 贴片无源晶振; Frequency Tolerance: ±10ppm; Frequency Stability: ±50ppm; Load Capacitance: 20pF; Symbol: X50328MSB2GI; Device: X50328MSB2GI; LCSC Part Name: YSX530GA 8MHZ  20PF 10PPM -40~+85; Supplier Part: C115962; Manufacturer Part: X50328MSB2GI; Supplier Footprint: SMD5032-2P; JLCPCB Part Class: Basic Part; Datasheet: https://atta.szlcsc.com/upload/public/pdf/source/20210329/C112559_847D3CACBA33ACCEB57DEA3AEBB187A1.pdf; Supplier: LCSC; Convert to PCB: yes; Value: 8MHz; Operating Temperature: -40~+85